# Altium schematic sheet k26_baseboard.SchDoc: k26 Baseboard
size A4; DrawnBy: Ch. Vogt; Organization: PBL; DocumentNumber: 1; Revision: r5; SheetNumber: 1
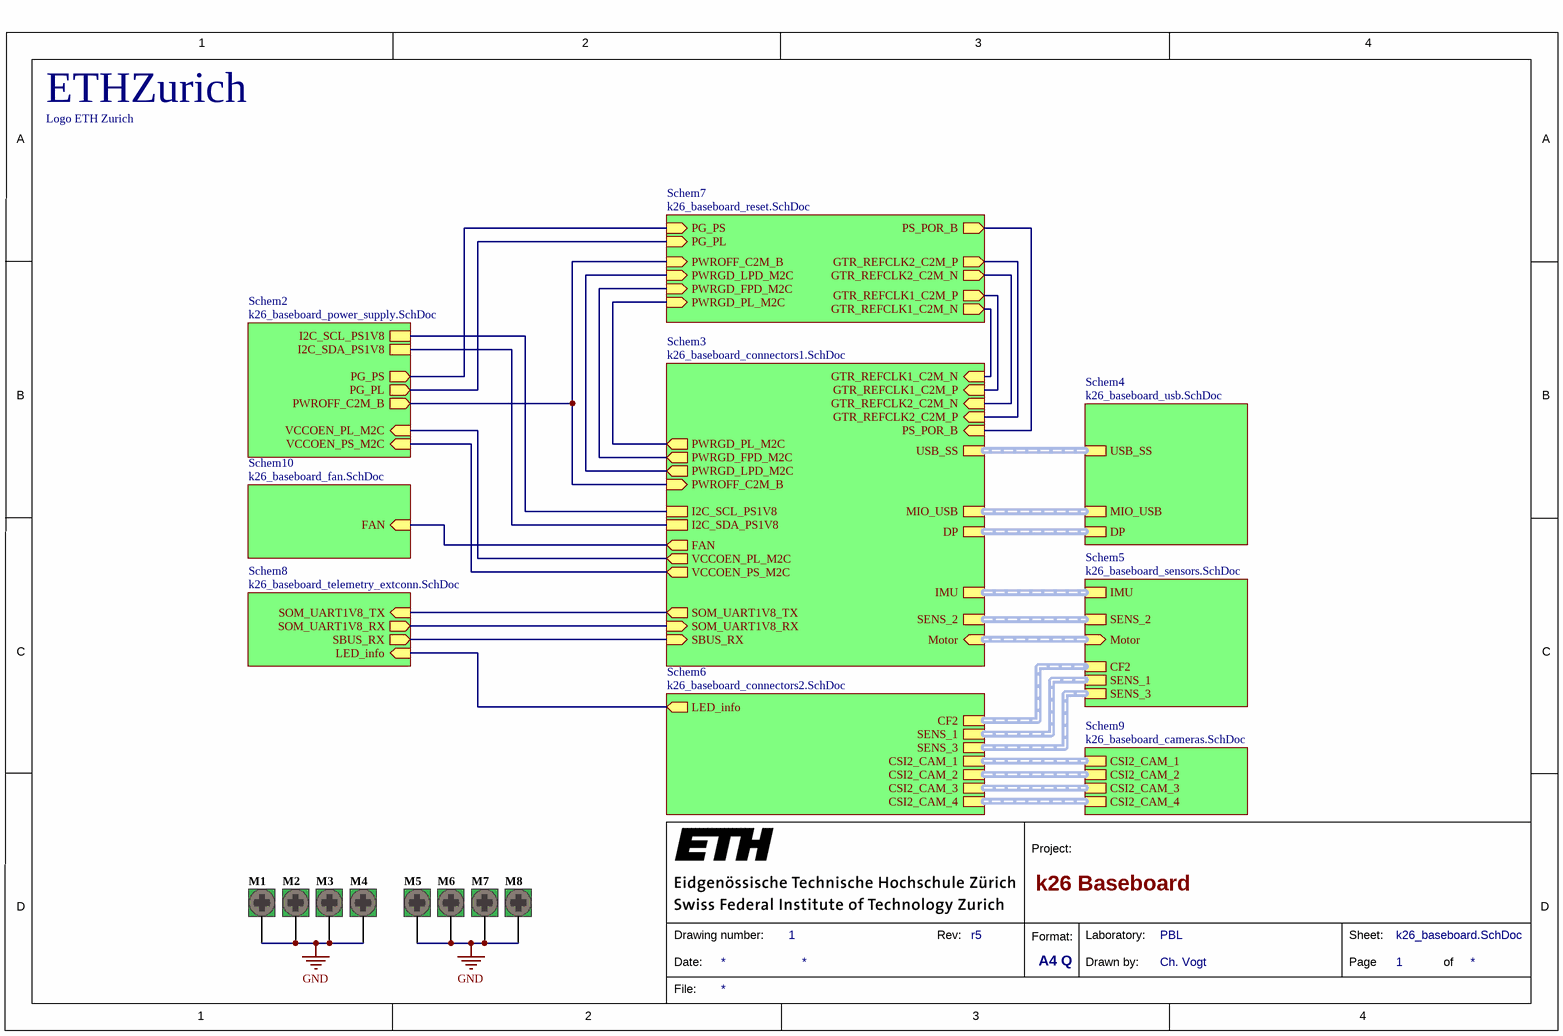
[diagram p0: k26_baseboard.SchDoc]

## Parts
A1  Logo ETH Zurich  [eth-zurich_2mm]  (no BOM)
M1  (no value)  [Hole M3]  (no BOM)
M2  (no value)  [Hole M3]  (no BOM)
M3  (no value)  [Hole M3]  (no BOM)
M4  (no value)  [Hole M3]  (no BOM)
M5  (no value)  [Hole M3]  (no BOM)
M6  (no value)  [Hole M3]  (no BOM)
M7  (no value)  [Hole M3]  (no BOM)
M8  (no value)  [Hole M3]  (no BOM)

## Sub-sheets
Schem2 = k26_baseboard_power_supply.SchDoc: PWROFF_C2M_B (out), PG_PS (out), VCCOEN_PS_M2C (in), PG_PL (out), VCCOEN_PL_M2C (in), I2C_SCL_PS1V8, I2C_SDA_PS1V8
Schem3 = k26_baseboard_connectors1.SchDoc: PWRGD_LPD_M2C (out), PWRGD_PL_M2C (out), GTR_REFCLK2_C2M_P (in), GTR_REFCLK2_C2M_N (in), MIO_USB (harness MIO_USB), PWRGD_FPD_M2C (out), PWROFF_C2M_B (in), VCCOEN_PS_M2C (out), VCCOEN_PL_M2C (out), FAN (out), SBUS_RX (in), Motor (in, harness MOTOR), SOM_UART1V8_TX (out), SOM_UART1V8_RX (in), DP (harness DP), GTR_REFCLK1_C2M_N (in), GTR_REFCLK1_C2M_P (in), USB_SS (harness USB_SS), I2C_SCL_PS1V8, I2C_SDA_PS1V8, PS_POR_B (in), SENS_2 (harness SENS), IMU (harness IMU)
Schem4 = k26_baseboard_usb.SchDoc: MIO_USB (harness MIO_USB), DP (harness DP), USB_SS (harness USB_SS)
Schem5 = k26_baseboard_sensors.SchDoc: Motor (in, harness MOTOR), SENS_2 (harness SENS), SENS_1 (harness SENS), SENS_3 (harness SENS), IMU (harness IMU), CF2 (harness CF2)
Schem6 = k26_baseboard_connectors2.SchDoc: CSI2_CAM_3 (harness CSI2), CSI2_CAM_4 (harness CSI2), CSI2_CAM_2 (harness CSI2), CSI2_CAM_1 (harness CSI2), SENS_3 (harness SENS), SENS_1 (harness SENS), CF2 (harness CF2), LED_info (out)
Schem7 = k26_baseboard_reset.SchDoc: GTR_REFCLK2_C2M_P (out), PWROFF_C2M_B (in), GTR_REFCLK2_C2M_N (out), PWRGD_LPD_M2C (in), PWRGD_FPD_M2C (in), PWRGD_PL_M2C (in), GTR_REFCLK1_C2M_N (out), GTR_REFCLK1_C2M_P (out), PG_PS (in), PG_PL (in), PS_POR_B (out)
Schem8 = k26_baseboard_telemetry_extconn.SchDoc: SBUS_RX (out), SOM_UART1V8_TX (in), SOM_UART1V8_RX (out), LED_info (in)
Schem9 = k26_baseboard_cameras.SchDoc: CSI2_CAM_3 (harness CSI2), CSI2_CAM_4 (harness CSI2), CSI2_CAM_1 (harness CSI2), CSI2_CAM_2 (harness CSI2)
Schem10 = k26_baseboard_fan.SchDoc: FAN (in)

## Nets
GND: M1.1 M2.1 M3.1 M4.1 M5.1 M6.1 M7.1 M8.1
(unnamed): sheet Schem2/PWROFF_C2M_B, sheet Schem3/PWROFF_C2M_B, sheet Schem7/PWROFF_C2M_B
(unnamed): sheet Schem2/PG_PS, sheet Schem7/PG_PS
(unnamed): sheet Schem2/VCCOEN_PS_M2C, sheet Schem3/VCCOEN_PS_M2C
(unnamed): sheet Schem2/PG_PL, sheet Schem7/PG_PL
(unnamed): sheet Schem2/VCCOEN_PL_M2C, sheet Schem3/VCCOEN_PL_M2C
(unnamed): sheet Schem2/I2C_SCL_PS1V8, sheet Schem3/I2C_SCL_PS1V8
(unnamed): sheet Schem2/I2C_SDA_PS1V8, sheet Schem3/I2C_SDA_PS1V8
(unnamed): sheet Schem3/PWRGD_LPD_M2C, sheet Schem7/PWRGD_LPD_M2C
(unnamed): sheet Schem3/PWRGD_PL_M2C, sheet Schem7/PWRGD_PL_M2C
(unnamed): sheet Schem3/GTR_REFCLK2_C2M_P, sheet Schem7/GTR_REFCLK2_C2M_P
(unnamed): sheet Schem3/GTR_REFCLK2_C2M_N, sheet Schem7/GTR_REFCLK2_C2M_N
(unnamed): sheet Schem3/PWRGD_FPD_M2C, sheet Schem7/PWRGD_FPD_M2C
(unnamed): sheet Schem3/FAN, sheet Schem10/FAN
(unnamed): sheet Schem3/SBUS_RX, sheet Schem8/SBUS_RX
(unnamed): sheet Schem3/SOM_UART1V8_TX, sheet Schem8/SOM_UART1V8_TX
(unnamed): sheet Schem3/SOM_UART1V8_RX, sheet Schem8/SOM_UART1V8_RX
(unnamed): sheet Schem3/GTR_REFCLK1_C2M_N, sheet Schem7/GTR_REFCLK1_C2M_N
(unnamed): sheet Schem3/GTR_REFCLK1_C2M_P, sheet Schem7/GTR_REFCLK1_C2M_P
(unnamed): sheet Schem3/PS_POR_B, sheet Schem7/PS_POR_B
(unnamed): sheet Schem8/LED_info, sheet Schem6/LED_info

## Buses and harness runs
harness sheet Schem3/DP = sheet Schem4/DP
harness sheet Schem3/IMU = sheet Schem5/IMU
harness sheet Schem3/MIO_USB = sheet Schem4/MIO_USB
harness sheet Schem3/Motor = sheet Schem5/Motor
harness sheet Schem3/SENS_2 = sheet Schem5/SENS_2
harness sheet Schem3/USB_SS = sheet Schem4/USB_SS
harness sheet Schem5/CF2 = sheet Schem6/CF2
harness sheet Schem5/SENS_1 = sheet Schem6/SENS_1
harness sheet Schem5/SENS_3 = sheet Schem6/SENS_3
harness sheet Schem6/CSI2_CAM_1 = sheet Schem9/CSI2_CAM_1
harness sheet Schem6/CSI2_CAM_2 = sheet Schem9/CSI2_CAM_2
harness sheet Schem6/CSI2_CAM_3 = sheet Schem9/CSI2_CAM_3
harness sheet Schem6/CSI2_CAM_4 = sheet Schem9/CSI2_CAM_4

## Notes on the sheet
- 1
- 2
- 3
- 4
- A
- B
- C
- Project:
- D
- Date:
- Drawing number:
- Rev:
- Format:
- A4 Q
- Drawn by:
- Laboratory:
- Page
- Sheet:
- of
- File:
- (in symbol CMP-00038-1) ETHZurich

## Library data of the parts
A1 = CMP-00038-1
M1-M8 = CMP-00902-1: M3 Hole, 3.2mm drill, 6.6mm landing pads, 3.9mm pad in middle layers; ClassName: Mounting Hole